# EAGLE design gate (EAGLE 9.2.2)
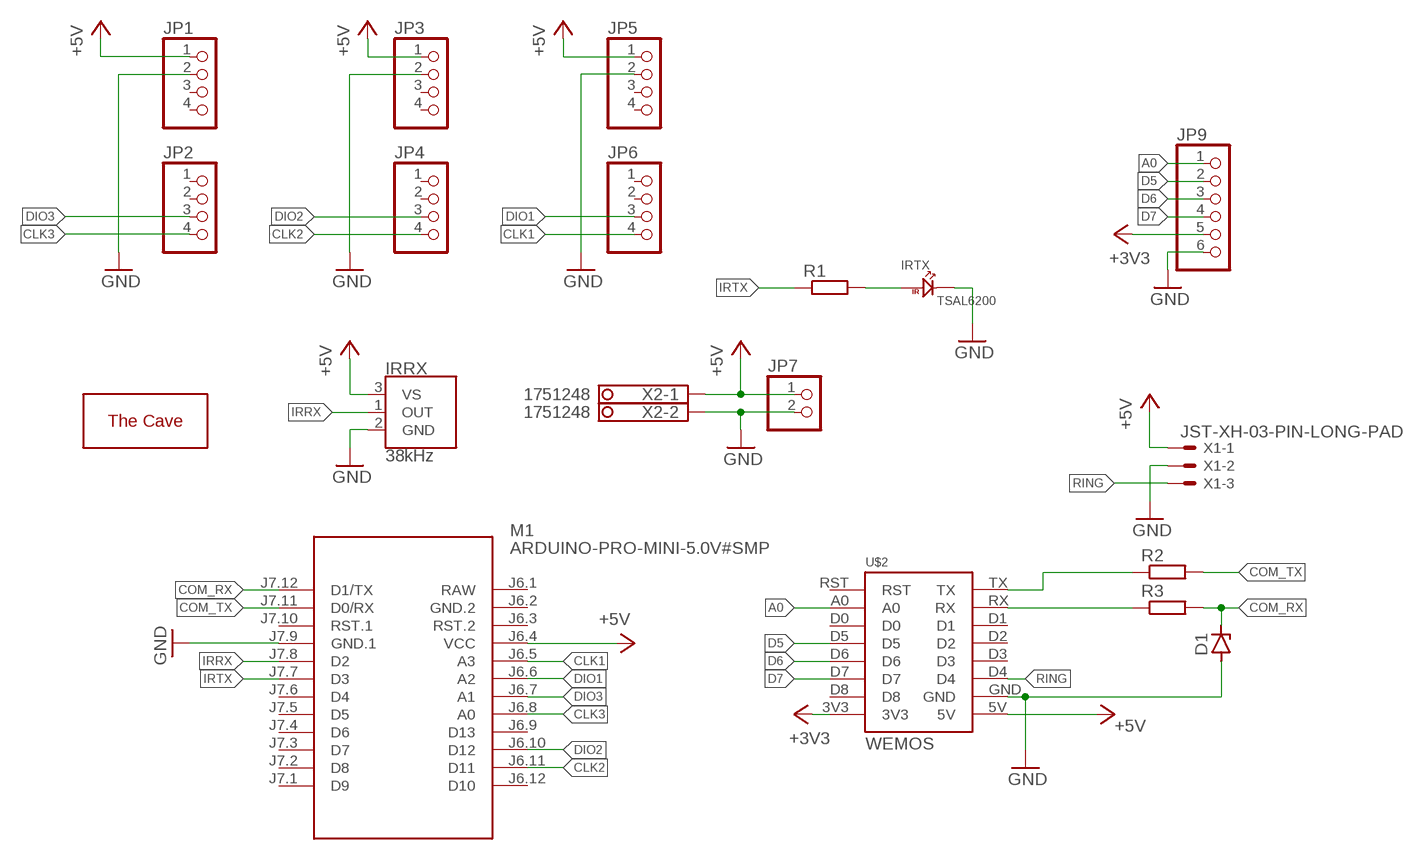
[diagram p0: schematic, sheet 1]

## Parts
D1  ZENER-DIODEDO34-7  [DO34Z7]
IRRX  38kHz  TSOP38238  [TSOP382]
IRTX  TSAL6200  [TSAL6200]
JP1  PINHD-1X4  [1X04]
JP2  PINHD-1X4  [1X04]
JP3  PINHD-1X4  [1X04]
JP4  PINHD-1X4  [1X04]
JP5  PINHD-1X4  [1X04]
JP6  PINHD-1X4  [1X04]
JP7  PINHD-1X2  [1X02]
JP9  PINHD-1X6  [1X06]
M1  ARDUINO-PRO-MINI-5.0V#SMP  [ARDUINO-PRO-MINI#SMP]
R1  R-EU_0207/7  [0207/7]
R2  R-EU_0207/7  [0207/7]
R3  R-EU_0207/7  [0207/7]
U$2  WEMOS  [WEMOS]
U$3  THECAVE_LOGO_NEW_TOP  [NEW_LOGO_TOP]
X1  JST-XH-03-PIN-LONG-PAD  [JST-XH-03-PACKAGE-LONG-PAD]
X2  1751248  [1751248]

## Nets
+3V3: JP9.5 U$2.3V3
+5V: IRRX.3(VS) JP1.1 JP3.1 JP5.1 JP7.1 M1.J6.4(VCC) U$2.5V X1.1 X2.1
A0: JP9.1 U$2.A0
CLK1: JP6.4 M1.J6.5(A3)
CLK2: JP4.4 M1.J6.11(D11)
CLK3: JP2.4 M1.J6.8(A0)
COM_RX: D1.C M1.J7.12(D1/TX) R3.2
COM_TX: M1.J7.11(D0/RX) R2.2
D5: JP9.2 U$2.D5
D6: JP9.3 U$2.D6
D7: JP9.4 U$2.D7
DIO1: JP6.3 M1.J6.6(A2)
DIO2: JP4.3 M1.J6.10(D12)
DIO3: JP2.3 M1.J6.7(A1)
GND: D1.A IRRX.2(GND) IRTX.N JP1.2 JP3.2 JP5.2 JP7.2 JP9.6 M1.J7.9(GND.1) U$2.GND X1.2 X2.2
IRRX: IRRX.1(OUT) M1.J7.8(D2)
IRTX: M1.J7.7(D3) R1.1
N$1: R2.1 U$2.TX
N$2: IRTX.P R1.2
N$4: R3.1 U$2.RX
RING: U$2.D4 X1.3
Unconnected: JP1.3 JP1.4 JP2.1 JP2.2 JP3.3 JP3.4 JP4.1 JP4.2 JP5.3 JP5.4 JP6.1 JP6.2 M1.J6.3(RST.2) M1.J6.9(D13) M1.J6.12(D10) M1.J7.1(D9) M1.J7.2(D8) M1.J7.3(D7) M1.J7.4(D6) M1.J7.5(D5) M1.J7.6(D4) M1.J7.10(RST.1) U$2.D0 U$2.D1 U$2.D2 U$2.D3 U$2.D8 U$2.RST

## Power pins joined to a net without a drawn wire
GND.2: M1.J6.2(GND.2)
RAW: M1.J6.1(RAW)

## Library data of the parts
D1 = diode:ZENER-DIODE: Z-Diode
IRRX = SparkFun-Sensors:TSOP382: Vishay Semiconductor TSOP32838 - 38kHz IR Receiver These products are miniaturized IR receiver modules for infrared remote control systems. A PIN diode and a preamplifier are assembled on a leadframe, the epoxy package contains an IR filter. The demodulated output signal can be directly connected to a microprocessor for decoding.; PROD_ID: SEN-10266
IRTX = Seeed-OPL-2017-01-Sensor-camilo:TSAL6200: 314020023
JP1-JP6 = pinhead:PINHD-1X4: PIN HEADER
JP7 = pinhead:PINHD-1X2: PIN HEADER
JP9 = pinhead:PINHD-1X6: PIN HEADER
M1 = diy-modules:ARDUINO-PRO-MINI-*#SMP: Arduino Pro Mini (and compatible devices) with 2 connectors only More details available here: https://www.arduino.cc/en/Main/ArduinoBoardProMini Click here to find device on ebay.com <http://www.ebay.com/sch/arduino+pro+mini>
R1-R3 = rcl:R-EU_: RESISTOR, European symbol; SPICEPREFIX: R
U$2 = d1-mini:WEMOS
U$3 = thecave:THECAVE_LOGO: The Cave DIY workshop logos thecave.cz
X1 = Rembrandt Electronics - JST XH Connectors v1-0:JST-XH-03-PIN: JST XH Connector 2 Pin Wire to board connector. Pitch: 2,54 mm, (0.100") Number of pins: 3 Created by Rembrandt Electronics www.rembrandtelectronics.com
X2 = con-phoenix-350:1751248: MKDS 1/ 2-3,5 Printklemme Nennstrom: 10 A Bemessungsspannung: 160 V Raster: 3,5 mm Polzahl: 2 Montageart: Löten Anschlussart: Schraubanschluss Anschlussrichtung vom Leiter zur Platine: 0° Source: http://eshop.phoenixcontact.com .. 1751248.pdf; OC_FARNELL: unknown; OC_NEWARK: unknown

## Board
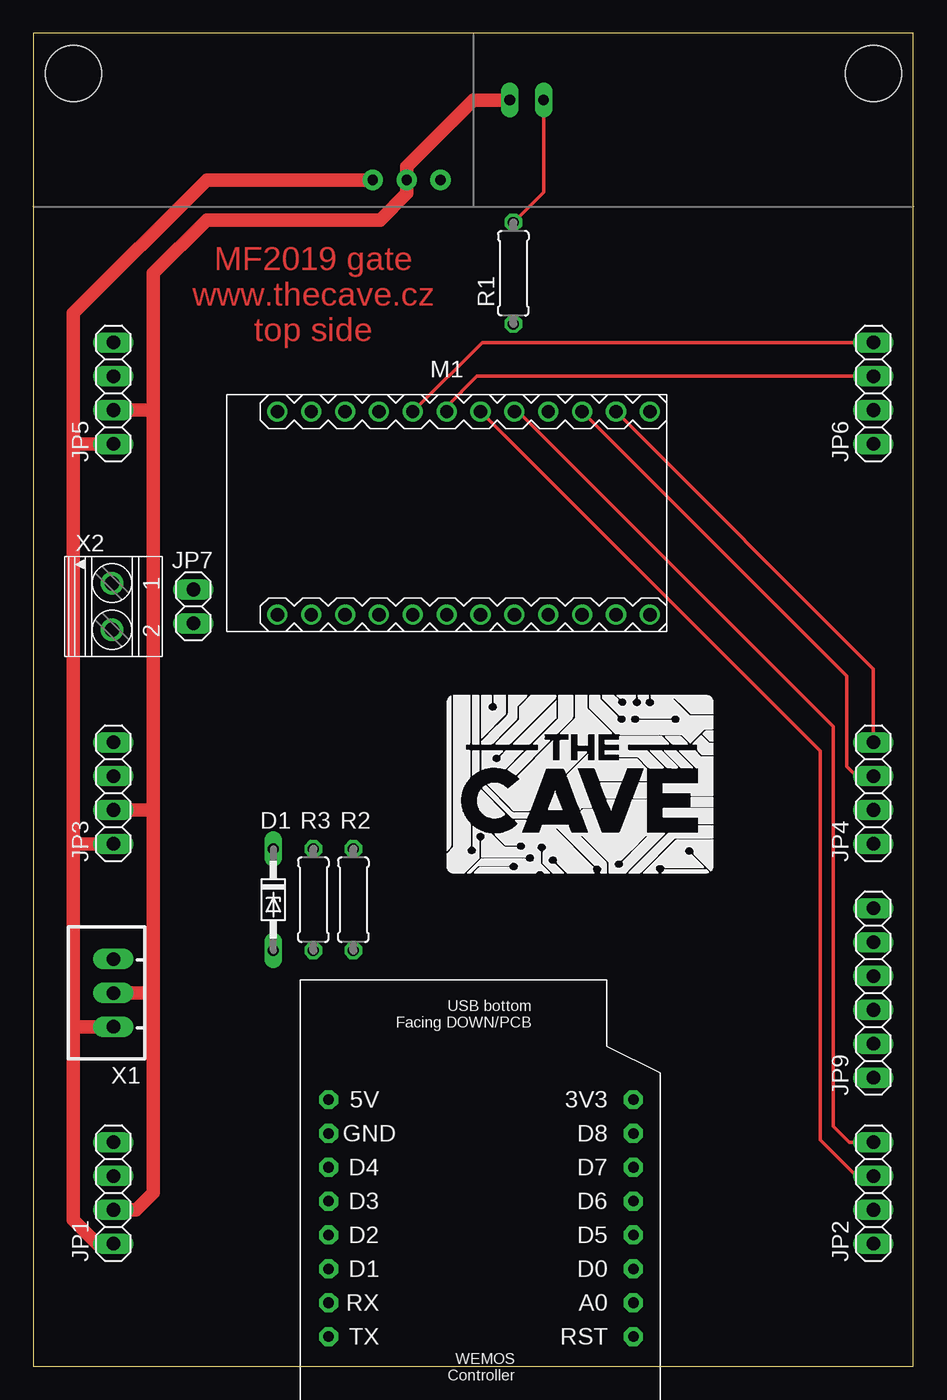
[diagram p1: board, top side]
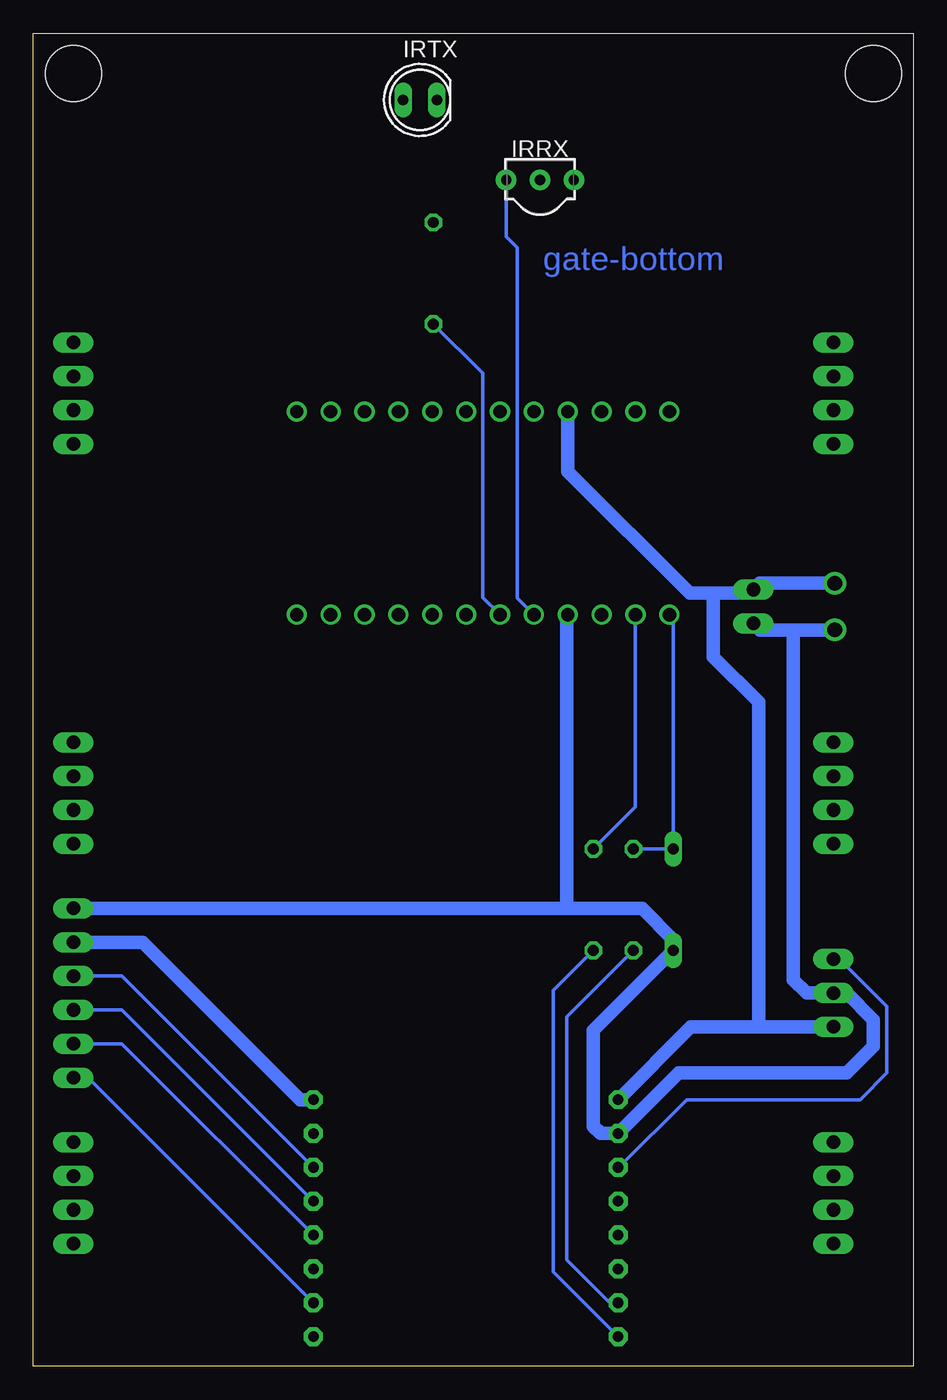
[diagram p2: board, bottom side, seen from below]

Size 66 x 100 mm. Coordinates in mm from the lower left corner, seen from the top.
Outline: 0,0 66,0 66,100 0,100 0,0
Copper layers (1*16): Top 0.035mm / dielectric 1.5mm / Bottom 0.035mm
Design rules "default": minimum track width 6mil, minimum drill 0.35mm, track to track 6mil, track to pad 6mil, pad to pad 6mil, via to via 6mil, smd to smd 6mil, copper to edge 40mil, drill to drill 6mil, minimum pad ring 10mil, minimum via ring 8mil, stop-mask expansion 4mil, vias tented up to drill 0mil, thermal gap 10mil
Holes 4.2 mm at 3,97 63,97

### Footprints (pad centres in the part's own frame; a part is rotated, then mirrored left to right if it is on the bottom)
DO34Z7 = drill 0.813 long: A 3.81,0; C -3.81,0
TSOP382 = drill 0.762 pad 1.524: 1 -2.54,0; 2 0,0; 3 2.54,0
TSAL6200 = drill 0.8 long: N 1.27,0; P -1.27,0
1X04 = drill 1.016 long: 1 -3.81,0; 2 -1.27,0; 3 1.27,0; 4 3.81,0
1X02 = drill 1.016 long: 1 -1.27,0; 2 1.27,0
1X06 = drill 1.016 long: 1 -6.35,0; 2 -3.81,0; 3 -1.27,0; 4 1.27,0; 5 3.81,0; 6 6.35,0
ARDUINO-PRO-MINI#SMP = drill 1: J6.1 -12.7,7.62; J6.2 -10.16,7.62; J6.3 -7.62,7.62; J6.4 -5.08,7.62; J6.5 -2.54,7.62; J6.6 0,7.62; J6.7 2.54,7.62; J6.8 5.08,7.62; J6.9 7.62,7.62; J6.10 10.16,7.62; J6.11 12.7,7.62; J6.12 15.24,7.62; J7.1 15.24,-7.62; J7.2 12.7,-7.62; J7.3 10.16,-7.62; J7.4 7.62,-7.62; J7.5 5.08,-7.62; J7.6 2.54,-7.62; J7.7 0,-7.62; J7.8 -2.54,-7.62; J7.9 -5.08,-7.62; J7.10 -7.62,-7.62; J7.11 -10.16,-7.62; J7.12 -12.7,-7.62
0207/7 = drill 0.813 octagon: 1 -3.81,0; 2 3.81,0
WEMOS = drill 0.8 pad 1.422 octagon: 3V3 0,0; 5V 22.86,0; A0 0,15.24; D0 0,12.7; D1 22.86,12.7; D2 22.86,10.16; D3 22.86,7.62; D4 22.86,5.08; D5 0,10.16; D6 0,7.62; D7 0,5.08; D8 0,2.54; GND 22.86,2.54; RST 0,17.78; RX 22.86,15.24; TX 22.86,17.78
JST-XH-03-PACKAGE-LONG-PAD = drill 1.016 long: 1 -2.54,0; 2 0,0; 3 2.54,0
1751248 = drill 1.1 pad 1.7: 1 -1.75,-0.1; 2 1.75,-0.1

### Placement (x,y rotation side)
D1  18,35 270 top
IRRX  28,89 0 bottom
IRTX  37,95 0 bottom
JP1  6,13 90 top
JP2  63,13 90 top
JP3  6,43 90 top
JP4  63,43 90 top
JP5  6,73 90 top
JP6  63,73 90 top
JP7  12,57 270 top
JP9  63,28 90 top
M1  31,64 0 top
R1  36,82 90 top
R2  24,35 90 top
R3  21,35 90 top
U$2  45,20 180 top
U$3  31,37 0 top
X1  6,28 90 top
X2  6,57 270 top

### Tracks (layer width: path | path; a pad name or v marks a point on that pad's centre or on a via)
+3V3
  Bottom 1.016: JP9.5 57.81,31.81 46,20 U$2.3V3
+5V
  Top 0.61: 3,69 3.19,69.19 | 3,25.46 3,26
  Top 1.016: JP1.1 4.81,9.19 3,11 3,25.46 X1.1 | 3,26 3,39.19 | 3,39.19 3,69 3,79 13,89 IRRX.3 | 3.19,69.19 JP5.1 | JP3.1 3,39.19
  Bottom 1.016: M1.J6.4 25.92,67.13 16.79,58 15,58 | X1.1 11.6,25.46 | 11.6,25.46 16.68,25.46 U$2.5V | 11.6,25.46 11.6,49.81 15,53.21 15,58 | X2.1 11.52,58.75 JP7.1 12.27,58 15,58
A0
  Bottom 0.254: U$2.A0 61.89,21.65 JP9.1
CLK1
  Top 0.254: JP6.4 33.65,76.81 M1.J6.5
CLK2
  Top 0.254: JP4.4 63,52.32 M1.J6.11
CLK3
  Top 0.254: JP2.4 61.19,16.81 60,18 60,48 36.38,71.62 M1.J6.8
COM_RX
  Bottom 0.254: M1.J7.12 18,56.08 D1.C R3.2
COM_TX
  Bottom 0.254: R2.2 20.84,41.97 M1.J7.11
D5
  Bottom 0.254: JP9.2 59.35,24.19 U$2.D5
D6
  Bottom 0.254: JP9.3 59.35,26.73 U$2.D6
D7
  Bottom 0.254: JP9.4 59.35,29.27 U$2.D7
DIO1
  Top 0.254: JP6.3 33.27,74.27 31,72 M1.J6.6
DIO2
  Top 0.254: JP4.3 61.73,44.27 61,45 61,51.78 M1.J6.10
DIO3
  Top 0.254: JP2.3 61.73,14.27 59,17 59,46.16 M1.J6.7
GND
  Top 0.61: 9,72 8.73,71.73
  Top 1.016: JP1.2 7.73,11.73 9,13 9,28 | 9,28 9,41.73 | 9,41.73 9,72 9,82 13,86 26,86 28,88 IRRX.2 28,90 33,95 IRTX.N | 8.73,71.73 JP5.2 | JP3.2 9,41.73 | X1.2 9,28
  Bottom 1.016: X2.2 9,55.25 | 9,55.25 11.52,55.25 JP7.2 | 9,55.25 9,29 8,28 X1.2 5,28 3,26 3,24 5,22 17.6,22 U$2.GND 23.46,17.46 24,18 24,25.19 D1.A 18,32 20.35,34.35 26,34.35 | M1.J7.9 26,56.38 26,34.35 | JP9.6 26,34.35
IRRX
  Bottom 0.254: M1.J7.8 29.7,57.62 29.7,83.9 30.54,84.74 IRRX.1
IRTX
  Bottom 0.254: M1.J7.7 32.3,57.68 32.3,74.49 R1.1
N$1
  Bottom 0.254: U$2.TX 27,7.08 27,28.19 R2.1
N$2
  Top 0.254: R1.2 38.27,88.08 IRTX.P
N$4
  Bottom 0.254: U$2.RX 22.76,4.76 26,8 26,26.19 R3.1
RING
  Bottom 0.254: X1.3 5.54,30.54 2,27 2,22 4,20 17,20 22.08,14.92 U$2.D4

### Text on the board
Top: MF2019 gate / www.thecave.cz / top side
Bottom: gate-bottom